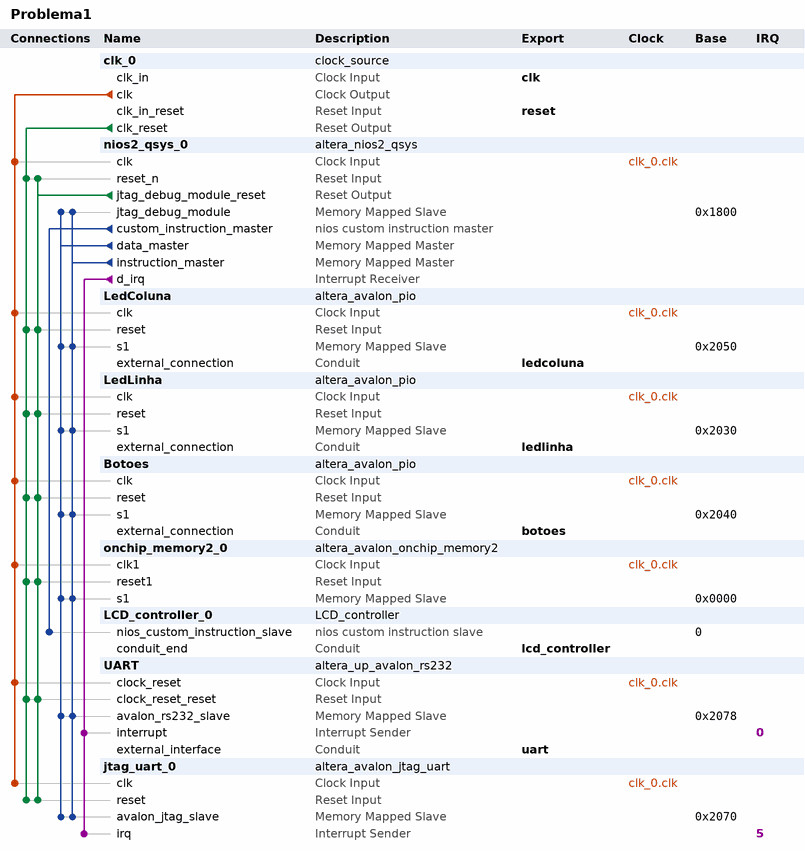
[diagram p0: system contents]
# Platform Designer (Qsys) system Problema1, Cyclone IV E EP4CE30F23C7
# Parameters at their usual value, and those the tool derives, are not listed.
package require -exact qsys 13.0.1.99.2
create_system Problema1
set_project_property DEVICE_FAMILY {Cyclone IV E}
set_project_property DEVICE EP4CE30F23C7

add_instance clk_0 clock_source 13.0
set_instance_parameter_value clk_0 clockFrequency 50000000

add_instance nios2_qsys_0 altera_nios2_qsys 13.0
set_instance_parameter_value nios2_qsys_0 resetSlave onchip_memory2_0.s1
set_instance_parameter_value nios2_qsys_0 mmu_TLBMissExcSlave None
set_instance_parameter_value nios2_qsys_0 exceptionSlave onchip_memory2_0.s1
set_instance_parameter_value nios2_qsys_0 breakSlave nios2_qsys_0.jtag_debug_module
set_instance_parameter_value nios2_qsys_0 impl Tiny
set_instance_parameter_value nios2_qsys_0 icache_size 4096

add_instance LedColuna altera_avalon_pio 13.0.1.99.2
set_instance_parameter_value LedColuna direction Output
set_instance_parameter_value LedColuna width 5

add_instance LedLinha altera_avalon_pio 13.0.1.99.2
set_instance_parameter_value LedLinha direction Output
set_instance_parameter_value LedLinha width 5

add_instance Botoes altera_avalon_pio 13.0.1.99.2
set_instance_parameter_value Botoes direction Input
set_instance_parameter_value Botoes width 4

add_instance onchip_memory2_0 altera_avalon_onchip_memory2 13.0.1.99.2
set_instance_parameter_value onchip_memory2_0 dataWidth 32
set_instance_parameter_value onchip_memory2_0 dualPort false
set_instance_parameter_value onchip_memory2_0 initMemContent true
set_instance_parameter_value onchip_memory2_0 initializationFileName onchip_mem.hex
set_instance_parameter_value onchip_memory2_0 memorySize 4096

add_instance LCD_controller_0 LCD_controller 1.0

add_instance UART altera_up_avalon_rs232 13.0
set_instance_parameter_value UART baud 115200
set_instance_parameter_value UART parity None

add_instance jtag_uart_0 altera_avalon_jtag_uart 13.0.1.99.2
set_instance_parameter_value jtag_uart_0 simInteractiveOptions NO_INTERACTIVE_WINDOWS

# connections
add_connection clk_0.clk Botoes.clk clock
add_connection clk_0.clk jtag_uart_0.clk clock
add_connection clk_0.clk LedColuna.clk clock
add_connection clk_0.clk LedLinha.clk clock
add_connection clk_0.clk nios2_qsys_0.clk clock
add_connection clk_0.clk onchip_memory2_0.clk1 clock
add_connection clk_0.clk UART.clock_reset clock
add_connection clk_0.clk_reset Botoes.reset reset
add_connection clk_0.clk_reset jtag_uart_0.reset reset
add_connection clk_0.clk_reset LedColuna.reset reset
add_connection clk_0.clk_reset LedLinha.reset reset
add_connection clk_0.clk_reset nios2_qsys_0.reset_n reset
add_connection clk_0.clk_reset onchip_memory2_0.reset1 reset
add_connection clk_0.clk_reset UART.clock_reset_reset reset
add_connection nios2_qsys_0.jtag_debug_module_reset Botoes.reset reset
add_connection nios2_qsys_0.jtag_debug_module_reset jtag_uart_0.reset reset
add_connection nios2_qsys_0.jtag_debug_module_reset LedColuna.reset reset
add_connection nios2_qsys_0.jtag_debug_module_reset LedLinha.reset reset
add_connection nios2_qsys_0.jtag_debug_module_reset nios2_qsys_0.reset_n reset
add_connection nios2_qsys_0.jtag_debug_module_reset onchip_memory2_0.reset1 reset
add_connection nios2_qsys_0.jtag_debug_module_reset UART.clock_reset_reset reset
add_connection nios2_qsys_0.data_master Botoes.s1 avalon
set_connection_parameter_value nios2_qsys_0.data_master/Botoes.s1 baseAddress 0x2040
add_connection nios2_qsys_0.data_master jtag_uart_0.avalon_jtag_slave avalon
set_connection_parameter_value nios2_qsys_0.data_master/jtag_uart_0.avalon_jtag_slave baseAddress 0x2070
add_connection nios2_qsys_0.data_master LedColuna.s1 avalon
set_connection_parameter_value nios2_qsys_0.data_master/LedColuna.s1 baseAddress 0x2050
add_connection nios2_qsys_0.data_master LedLinha.s1 avalon
set_connection_parameter_value nios2_qsys_0.data_master/LedLinha.s1 baseAddress 0x2030
add_connection nios2_qsys_0.data_master nios2_qsys_0.jtag_debug_module avalon
set_connection_parameter_value nios2_qsys_0.data_master/nios2_qsys_0.jtag_debug_module baseAddress 0x1800
add_connection nios2_qsys_0.data_master onchip_memory2_0.s1 avalon
set_connection_parameter_value nios2_qsys_0.data_master/onchip_memory2_0.s1 baseAddress 0x0000
add_connection nios2_qsys_0.data_master UART.avalon_rs232_slave avalon
set_connection_parameter_value nios2_qsys_0.data_master/UART.avalon_rs232_slave baseAddress 0x2078
add_connection nios2_qsys_0.instruction_master Botoes.s1 avalon
set_connection_parameter_value nios2_qsys_0.instruction_master/Botoes.s1 baseAddress 0x2040
add_connection nios2_qsys_0.instruction_master jtag_uart_0.avalon_jtag_slave avalon
set_connection_parameter_value nios2_qsys_0.instruction_master/jtag_uart_0.avalon_jtag_slave baseAddress 0x2070
add_connection nios2_qsys_0.instruction_master LedColuna.s1 avalon
set_connection_parameter_value nios2_qsys_0.instruction_master/LedColuna.s1 baseAddress 0x2050
add_connection nios2_qsys_0.instruction_master LedLinha.s1 avalon
set_connection_parameter_value nios2_qsys_0.instruction_master/LedLinha.s1 baseAddress 0x2030
add_connection nios2_qsys_0.instruction_master nios2_qsys_0.jtag_debug_module avalon
set_connection_parameter_value nios2_qsys_0.instruction_master/nios2_qsys_0.jtag_debug_module baseAddress 0x1800
add_connection nios2_qsys_0.instruction_master onchip_memory2_0.s1 avalon
set_connection_parameter_value nios2_qsys_0.instruction_master/onchip_memory2_0.s1 baseAddress 0x0000
add_connection nios2_qsys_0.instruction_master UART.avalon_rs232_slave avalon
set_connection_parameter_value nios2_qsys_0.instruction_master/UART.avalon_rs232_slave baseAddress 0x2078
add_connection nios2_qsys_0.d_irq jtag_uart_0.irq interrupt
set_connection_parameter_value nios2_qsys_0.d_irq/jtag_uart_0.irq irqNumber 5
add_connection nios2_qsys_0.d_irq UART.interrupt interrupt
set_connection_parameter_value nios2_qsys_0.d_irq/UART.interrupt irqNumber 0
add_connection nios2_qsys_0.custom_instruction_master LCD_controller_0.nios_custom_instruction_slave nios_custom_instruction
set_connection_parameter_value nios2_qsys_0.custom_instruction_master/LCD_controller_0.nios_custom_instruction_slave CIName lcd_controller_0
set_connection_parameter_value nios2_qsys_0.custom_instruction_master/LCD_controller_0.nios_custom_instruction_slave baseAddress 0

# exported interfaces
add_interface clk clock sink
set_interface_property clk EXPORT_OF clk_0.clk_in
add_interface reset reset sink
set_interface_property reset EXPORT_OF clk_0.clk_in_reset
add_interface botoes conduit end
set_interface_property botoes EXPORT_OF Botoes.external_connection
add_interface ledlinha conduit end
set_interface_property ledlinha EXPORT_OF LedLinha.external_connection
add_interface ledcoluna conduit end
set_interface_property ledcoluna EXPORT_OF LedColuna.external_connection
add_interface lcd_controller conduit end
set_interface_property lcd_controller EXPORT_OF LCD_controller_0.conduit_end
add_interface uart conduit end
set_interface_property uart EXPORT_OF UART.external_interface

set_interconnect_requirement {$system} qsys_mm.clockCrossingAdapter HANDSHAKE
set_interconnect_requirement {$system} qsys_mm.maxAdditionalLatency 1

save_system Problema1.qsys
